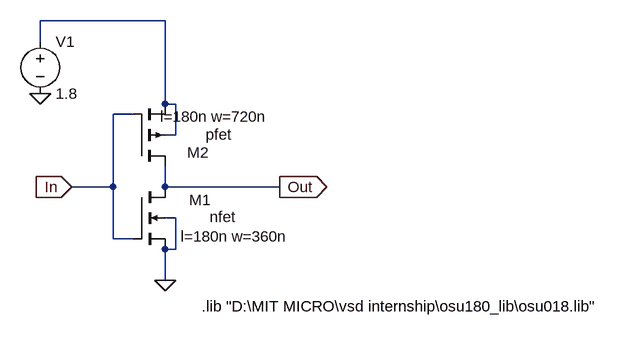
[diagram p0: schematic inv_20_10.asc]
inv_20_10.asc, the LTspice schematic file:
Version 4
SHEET 1 1196 680
WIRE 448 -432 256 -432
WIRE 256 -400 256 -432
WIRE 448 -304 448 -432
WIRE 464 -304 448 -304
WIRE 400 -288 368 -288
WIRE 464 -256 464 -304
WIRE 464 -256 448 -256
WIRE 368 -176 368 -288
WIRE 368 -176 304 -176
WIRE 448 -176 448 -208
WIRE 624 -176 448 -176
WIRE 464 -128 448 -128
WIRE 368 -96 368 -176
WIRE 400 -96 368 -96
WIRE 464 -80 464 -128
WIRE 464 -80 448 -80
WIRE 448 -32 448 -80
FLAG 304 -176 In
IOPIN 304 -176 In
FLAG 624 -176 Out
IOPIN 624 -176 Out
FLAG 448 -32 0
FLAG 256 -320 0
SYMBOL nmos4 400 -176 R0
WINDOW 0 119 20 Right 2
WINDOW 3 157 46 Right 2
WINDOW 123 238 76 Right 2
SYMATTR InstName M1
SYMATTR Value nfet
SYMATTR Value2 l=180n w=360n
SYMBOL pmos4 400 -208 M180
WINDOW 0 116 21 Right 2
WINDOW 3 151 49 Right 2
WINDOW 123 206 76 Right 2
SYMATTR InstName M2
SYMATTR Value pfet
SYMATTR Value2 l=180n w=720n
SYMBOL voltage 256 -416 R0
WINDOW 123 0 0 Left 0
WINDOW 39 0 0 Left 0
SYMATTR InstName V1
SYMATTR Value 1.8
TEXT 504 8 Left 2 !.lib "D:\\MIT MICRO\\vsd internship\\osu180_lib\\osu018.lib"

The netlist it stands for:
* inv_20_10.asc
M1 Out In 0 0 nfet l=180n w=360n
M2 Out In N001 N001 pfet l=180n w=720n
V1 N001 0 1.8
.model NMOS NMOS
.model PMOS PMOS
.lib standard.mos
.lib "D:\MIT MICRO\vsd internship\osu180_lib\osu018.lib"
.backanno
.end